# Altium schematic sheet FE.SchDoc: ThunderScope 1000E
size A4; Revision: 1
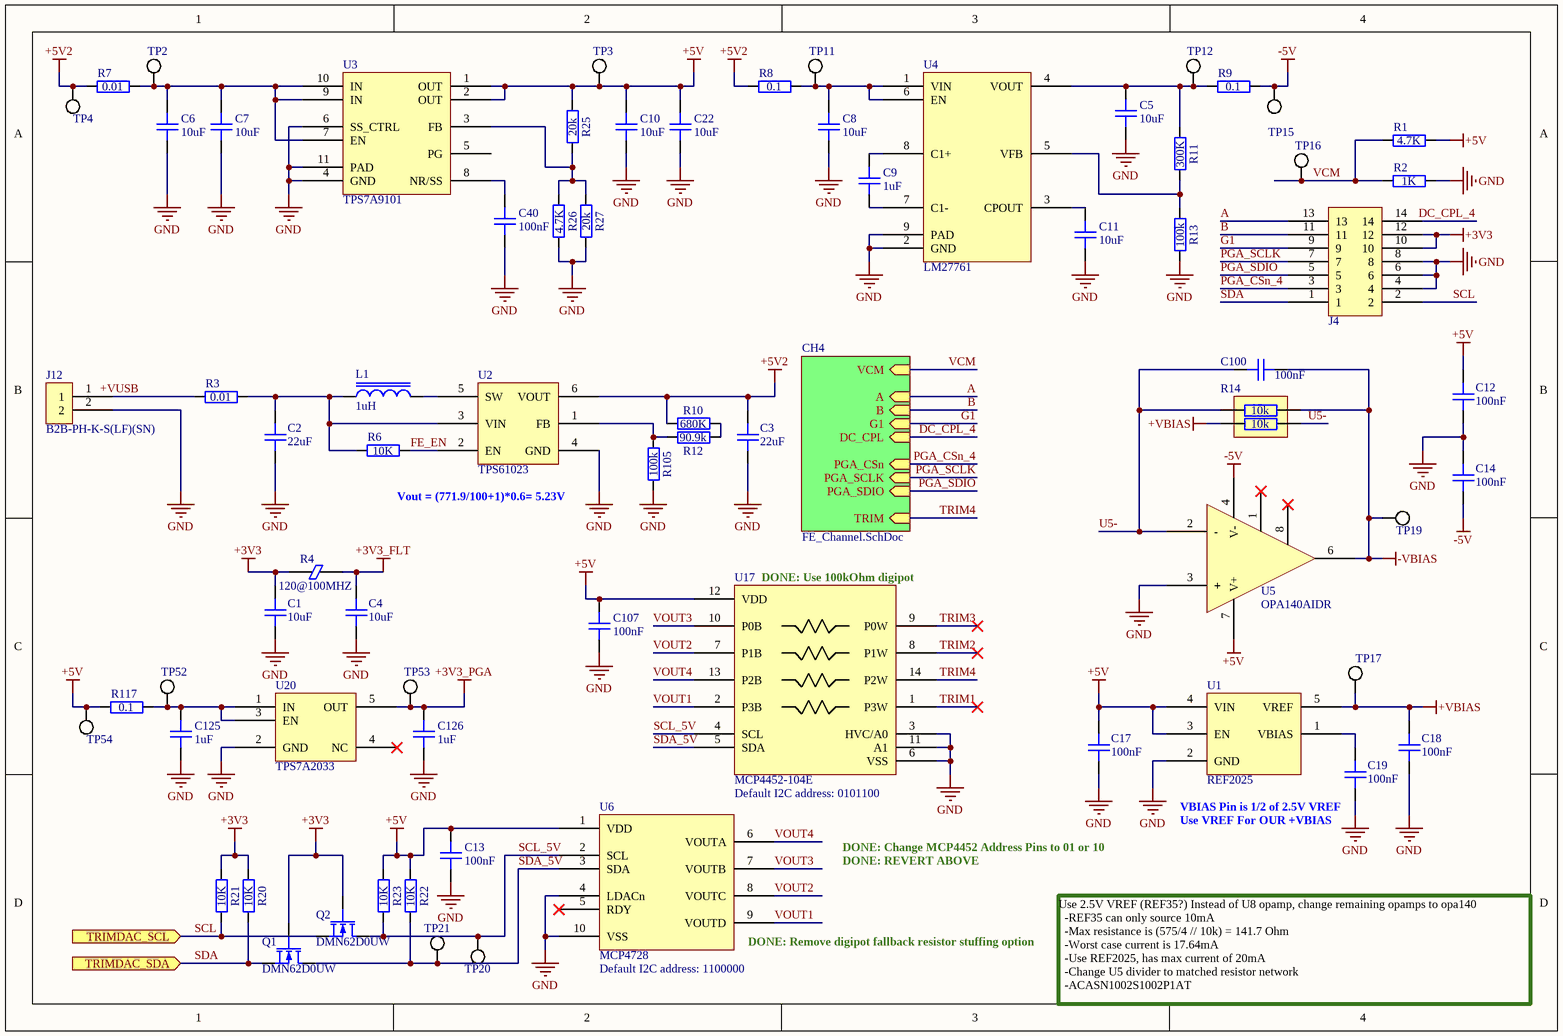
[diagram p0: FE.SchDoc]

## Parts
C1  10uF  [GEN_C_0603]
C2  22uF  [GEN_C_0805]
C3  22uF  [GEN_C_0805]
C4  10uF  [GEN_C_0603]
C5  10uF  [GEN_C_0603]
C6  10uF  [GEN_C_0603]
C7  10uF  [GEN_C_0603]
C8  10uF  [GEN_C_0603]
C9  1uF  [GEN_C_0402]
C10  10uF  [GEN_C_0603]
C11  10uF  [GEN_C_0603]
C12  100nF  [GEN_C_0402]
C13  100nF  [GEN_C_0402]
C14  100nF  [GEN_C_0402]
C17  100nF  [GEN_C_0402]
C18  100nF  [GEN_C_0402]
C19  100nF  [GEN_C_0402]
C22  10uF  [GEN_C_0603]
C40  100nF  [GEN_C_0402]
C100  100nF  [GEN_C_0402]
C107  100nF  [GEN_C_0402]
C125  1uF  [GEN_C_0402]
C126  1uF  [GEN_C_0402]
J4  2.54mm 2X7 Pin TH  [GEN_2.54mm_2X7_Pin_TH_RA]  (value not drawn)
J12  B2B-PH-K-S(LF)(SN)  [JST_B2B-PH-K-S(LF)(SN)]
L1  1uH  [GEN_L_1210]
Q1  DMN62D0UW  [GEN_SOT_323]
Q2  DMN62D0UW  [GEN_SOT_323]
R1  4.7K  [GEN_R_0402]
R2  1K  [GEN_R_0402]
R3  0.01  [GEN_R_0603]
R4  120@100MHZ  [GEN_R_0402]
R6  10K  [GEN_R_0402]
R7  0.01  [GEN_R_0603]
R8  0.1  [GEN_R_0402]
R9  0.1  [GEN_R_0402]
R10  680K  [GEN_R_0402]
R11  300K  [GEN_R_0402]
R12  90.9k  [GEN_R_0402]
R13  100k  [GEN_R_0402]
R14  10K  [GEN_R_2ARRAY_0606]  (value not drawn)
R20  10K  [GEN_R_0402]
R21  10K  [GEN_R_0402]
R22  10K  [GEN_R_0402]
R23  10K  [GEN_R_0402]
R25  20k  [GEN_R_0402]
R26  4.7K  [GEN_R_0402]
R27  20k  [GEN_R_0402]
R105  100k  [GEN_R_0402]
R117  0.1  [GEN_R_0402]
TP2  PCB  [GEN_TP_PCB]  (value not drawn)  (no BOM)
TP3  PCB  [GEN_TP_PCB]  (value not drawn)  (no BOM)
TP4  PCB  [GEN_TP_PCB]  (value not drawn)  (no BOM)
TP11  PCB  [GEN_TP_PCB]  (value not drawn)  (no BOM)
TP12  PCB  [GEN_TP_PCB]  (value not drawn)  (no BOM)
TP15  PCB  [GEN_TP_PCB]  (value not drawn)  (no BOM)
TP16  PCB  [GEN_TP_PCB]  (value not drawn)  (no BOM)
TP17  PCB  [GEN_TP_PCB]  (value not drawn)  (no BOM)
TP19  PCB  [GEN_TP_PCB]  (value not drawn)  (no BOM)
TP20  PCB  [GEN_TP_PCB]  (value not drawn)  (no BOM)
TP21  PCB  [GEN_TP_PCB]  (value not drawn)  (no BOM)
TP52  PCB  [GEN_TP_PCB]  (value not drawn)  (no BOM)
TP53  PCB  [GEN_TP_PCB]  (value not drawn)  (no BOM)
TP54  PCB  [GEN_TP_PCB]  (value not drawn)  (no BOM)
U1  REF2025  [GEN_SOT23_5_950_2900X1600X1450]
U2  TPS61023  [TI_SOT563_DRL0006A]
U3  TPS7A9101  [TI_WSON10_DSK0010A]
U4  LM27761  [TI_WSON8_DSG0008A]
U5  OPA140AIDR  [TI_SOIC8_D0008A]
U6  MCP4728  [MC_MSOP10_UN]
U17  MCP4452-104E  [MC_TSSOP14]
U20  TPS7A2033  [GEN_SOT23_5_950_2900X1600X1450]

## Sub-sheets
CH4 = FE_Channel.SchDoc: VCM (in), TRIM (in), B (in), DC_CPL (in), PGA_CSn (in), PGA_SCLK (in), PGA_SDIO (in), A (in), G1 (in)

## Ports
TRIMDAC_SCL (in), TRIMDAC_SDA (in)

## Nets
+3V3: C1.2 J4.10 J4.12 Q1.2(G) Q2.2(G) R4.1 R20.2 R21.2
+3V3_FLT: C4.2 R4.2
+3V3_PGA: C126.2 TP53.1 U20.5(OUT)
+5V: C10.2 C12.1 C13.2 C17.1 C22.2 C107.2 R1.2 R22.2 R23.2 R25.2 R117.1 TP3.1 TP54.1 U1.3(EN) U1.4(VIN) U3.1(OUT) U3.2(OUT) U5.7(V+) U6.1(VDD) U17.12(VDD)
+5V2: C3.2 R7.1 R8.1 R10.2 TP4.1 U2.6(VOUT)
+VBIAS: C18.1 R14.2 TP17.1 U1.5(VREF)
-5V: C14.2 R9.2 TP15.1 U5.4(V-)
-VBIAS: C100.1 R14.4 TP19.1 U5.6(OUT)
GND: C1.1 C2.1 C3.1 C4.1 C5.1 C6.1 C7.1 C8.1 C10.1 C11.1 C12.2 C13.1 C14.1 C17.2 C18.2 C19.1 C22.1 C40.1 C107.1 C125.1 C126.1 J4.4 J4.6 J4.8 J12.2 R2.2 R13.1 R26.1 R27.1 R105.1 U1.2(GND) U2.4(GND) U3.4(GND) U3.6(SS_CTRL) U3.11(PAD) U4.2(GND) U4.9(PAD) U5.3(+) U6.4(LDACn) U6.10(VSS) U17.3(HVC/A0) U17.6(VSS) U17.11(A1) U20.2(GND)
+VUSB: J12.1 R3.2
A: J4.13 ; sheet CH4/A
B: J4.11 ; sheet CH4/B
DC_CPL_4: J4.14 ; sheet CH4/DC_CPL
FE_EN: R6.1 U2.2(EN)
G1: J4.9 ; sheet CH4/G1
PGA_CSn_4: J4.3 ; sheet CH4/PGA_CSn
PGA_SCLK: J4.7 ; sheet CH4/PGA_SCLK
PGA_SDIO: J4.5 ; sheet CH4/PGA_SDIO
SCL: J4.2 Q2.3(S) R21.1 ; port TRIMDAC_SCL
SCL_5V: Q2.1(D) R23.1 TP20.1 U6.2(SCL) U17.4(SCL)
SDA: J4.1 Q1.3(S) R20.1 ; port TRIMDAC_SDA
SDA_5V: Q1.1(D) R22.1 TP21.1 U6.3(SDA) U17.5(SDA)
TRIM1: U17.1(P3W)
TRIM2: U17.8(P1W)
TRIM3: U17.9(P0W)
TRIM4: U17.14(P2W) ; sheet CH4/TRIM
U5-: C100.2 R14.1 R14.3 U5.2(-)
VCM: R1.1 R2.1 TP16.1 ; sheet CH4/VCM
VOUT1: U6.9(VOUTD) U17.2(P3B)
VOUT2: U6.8(VOUTC) U17.7(P1B)
VOUT3: U6.7(VOUTB) U17.10(P0B)
VOUT4: U6.6(VOUTA) U17.13(P2B)
NetC2_2: C2.2 L1.1 R3.1 R6.2 U2.3(VIN)
NetC5_2: C5.2 R9.1 R11.2 TP12.1 U4.4(VOUT)
NetC6_2: C6.2 C7.2 R7.2 TP2.1 U3.7(EN) U3.9(IN) U3.10(IN)
NetC8_2: C8.2 R8.2 TP11.1 U4.1(VIN) U4.6(EN)
NetC9_1: C9.1 U4.7(C1-)
NetC9_2: C9.2 U4.8(C1+)
NetC11_2: C11.2 U4.3(CPOUT)
NetC19_2: C19.2 U1.1(VBIAS)
NetC40_2: C40.2 U3.8(NR/SS)
NetC125_2: C125.2 R117.2 TP52.1 U20.1(IN) U20.3(EN)
NetL1_2: L1.2 U2.5(SW)
NetR10_1: R10.1 R12.2
NetR11_1: R11.1 R13.2 U4.5(VFB)
NetR12_1: R12.1 R105.2 U2.1(FB)
NetR25_1: R25.1 R26.2 R27.2 U3.3(FB)

Not connected (* = marked no-connect by the designer): U3 5(PG); U5 1(N1)* 8(N2)*; U6 5(RDY)*; U20 4(NC)*

## Notes on the sheet
- Vout = (771.9/100+1)*0.6= 5.23V
- (near U17) DONE: Use 100kOhm digipot
- Default I2C address: 0101100
- DONE: Change MCP4452 Address Pins to 01 or 10
- (near C19) VBIAS Pin is 1/2 of 2.5V VREF
- Use VREF For OUR +VBIAS
- DONE: REVERT ABOVE
- (near U6) Default I2C address: 1100000
- (near U6) DONE: Remove digipot fallback resistor stuffing option
- Use 2.5V VREF (REF35?) Instead of U8 opamp, change remaining opamps to opa140
  -REF35 can only source 10mA
  -Max resistance is (575/4 // 10k) = 141.7 Ohm
  -Worst case current is 17.64mA
  -Use REF2025, has max current of 20mA
  -Change U5 divider to matched resistor network
  -ACASN1002S1002P1AT
- Aleksa Bjelogrlic
- (in symbol RES ARRAY 2x 10K OHM 0.05% 0606) 10k

## Library data of the parts
C1 C4 = CAP 10uF 10V X5R 0603: Manufacturer: Murata; House Part Number: C-10uF-0603-002; Manufacturer Part Number: GRM188R61A106ME69D; Voltage Rating: 10V; Package: 0402; Value: 10uF; Supplier 1: Mouser; Supplier Part Number 1: 81-GRM188R61A106ME9D
C2 C3 = CAP 22uF 25V X5R 0805: House Part Number: C-22uF-0805-002; Manufacturer: Murata; Manufacturer Part Number: GRM21BR61E226ME44L; Voltage Rating: 25V; Package: 0805; Value: 22uF; Supplier 1: Mouser; Supplier Part Number 1: 81-GRM21BR61E226ME4L
C5-C8 C10 C11 C22 = CAP 10uF 10V X5R 0603: House Part Number: C-10uF-0603-002; Manufacturer: Murata; Manufacturer Part Number: GRM188R61A106ME69D; Voltage Rating: 10V; Package: 0402; Supplier 1: Mouser; Supplier Part Number 1: 81-GRM188R61A106ME9D; Value: 10uF
C9 C125 C126 = CAP 1uF 25V X5R 0402: Manufacturer: Murata; Manufacturer Part Number: GRM155R61E105KA12D; Voltage Rating: 25V; Package: 0402; Supplier 1: Mouser; Supplier Part Number 1: 81-GRM155R61E105KA2D; Value: 1uF
C12-C14 C17-C19 C100 C107 = CAP 100nF 16V X7R 0402: House Part Number: C-100nF-0402-002; Manufacturer: Murata; Manufacturer Part Number: GCM155R71C104KA55D; Voltage Rating: 16V; Package: 0402; Supplier 1: Mouser; Supplier Part Number 1: 81-GCM155R71C104KA5D; Value: 100nF
C40 = CAP 100nF 16V X7R 0402: Manufacturer: Murata; House Part Number: C-100nF-0402-002; Manufacturer Part Number: GCM155R71C104KA55D; Voltage Rating: 16V; Package: 0402; Supplier 1: Mouser; Supplier Part Number 1: 81-GCM155R71C104KA5D; Value: 100nF
J4 = CONN 2.54mm 2X7 Pin TH RA: Supplier 1: Digi-Key; Supplier Part Number 1: S9203-ND
J12 = CONN JST PH 2 Pin TH: Manufacturer: JST; Manufacturer Part Number: B2B-PH-K-S-LF-SN; Supplier 1: Digi-Key; Supplier Part Number 1: 455-1704-ND
L1 = IND 1uH 3.1A 45 MOHM 1210: Manufacturer: Murata; Manufacturer Part Number: 1277AS-H-1R0M=P2; Value: 1uH; Supplier 1: Mouser; Supplier Part Number 1: 81-1277AS-H-1R0MP2
Q1 Q2 = NMOS DMN62D0UW: House Part Number: DMN62D0UW-7; Manufacturer: Diodes; Vdss: 60V; Supplier 1: Mouser; Supplier Part Number 1: 621-DMN62D0UW-7; Manufacturer Part Number: DMN62D0UW-7
R1 R26 = RES 4.7K OHM 1% 1/10W 0402: Manufacturer: Panasonic; Manufacturer Part Number: ERJ-2RKF4701X; Tolerance: 1%; Package: 0402; Supplier 1: Mouser; Supplier Part Number 1: 667-ERJ-2RKF4701X; Value: 4.7K
R2 = RES 1K OHM 1% 1/10W 0402: Manufacturer: Yageo; House Part Number: R-1K-0402-1%-001; Manufacturer Part Number: RC0402FR-071KL; Tolerance: 1%; Package: 0402; Value: 1K; Supplier 1: Mouser; Supplier Part Number 1: 603-RC0402FR-071KL
R3 R7 = RES 0.01 OHM 1% 1/4W 0603: House Part Number: R-0.01-0603-1%-001; Manufacturer: Susumu; Manufacturer Part Number: RL0816T-R010-F; Tolerance: 1%; Supplier 1: Mouser; Supplier Part Number 1: 754-RL0816T-R010-F; Value: 0.01; Package: 0603
R4 = FERRITE BEAD 120 OHM 0402: Manufacturer: Murata; House Part Number: BLM15PX121SN1D; Manufacturer Part Number: BLM15PX121SN1D; Supplier 1: Mouser; Supplier Part Number 1: 81-BLM15PX121SN1D
R6 R20-R23 = RES 10K OHM 1% 1/10W 0402: Manufacturer: Panasonic; Manufacturer Part Number: ERJ-2RKF1002X; Tolerance: 1%; Package: 0402; Supplier 1: Mouser; Supplier Part Number 1: 667-ERJ-2RKF1002X; Value: 10K
R8 R9 R117 = RES 0.1 OHM 1% 1/6W 0402: Manufacturer: Panasonic; Manufacturer Part Number: ERJ-2BSFR10X; Tolerance: 1%; Package: 0402; Supplier 1: Mouser; Supplier Part Number 1: 667-ERJ-2BSFR10X; Value: 0.1
R10 = RES 680K OHM 1% 1/16W 0402: Manufacturer: Yageo; Manufacturer Part Number: RC0402FR-07681KL; Tolerance: 1%; Package: 0402; Supplier 1: Mouser; Supplier Part Number 1: 603-RC0402FR-07680KL; Value: 680K
R11 = RES 300K OHM 1% 1/10W 0402: Manufacturer: Panasonic; Manufacturer Part Number: ERJ-2RKF3003X; Tolerance: 1%; Package: 0402; Supplier 1: Mouser; Supplier Part Number 1: 667-ERJ-2RKF3003X; Value: 300K
R12 = RES 90.9K OHM 1% 1/16W 0402: Manufacturer: Yageo; Manufacturer Part Number: RC0402FR-0790K9L; Tolerance: 1%; Package: 0402; Supplier 1: Mouser; Supplier Part Number 1: 603-RC0402FR-0790K9L; Value: 90.9k
R13 R105 = RES 100K OHM 1% 1/10W 0402: House Part Number: R-100K-0402-1%-001; Manufacturer: Yageo; Manufacturer Part Number: RC0402FR-07100KL; Tolerance: 1%; Package: 0402; Supplier 1: Mouser; Supplier Part Number 1: 603-RC0402FR-07100KL; Value: 100k
R14 = RES ARRAY 2x 10K OHM 0.05% 0606: Manufacturer: Vishay Beyschlag; Manufacturer Part Number: ACASN1002S1002P1ATF1002X; Tolerance: 1%; Package: 0606; Value: 10K; Supplier 1: Mouser; Supplier Part Number 1: 594-ACASN1002S1002AT
R25 R27 = RES 20K OHM 1% 1/16W 0402: Manufacturer: Yageo; Manufacturer Part Number: RC0402FR-0720KL; Tolerance: 1%; Package: 0402; Supplier 1: Mouser; Supplier Part Number 1: 603-RC0402FR-0720KL; Value: 20k
TP2-TP4 TP11 TP12 TP15-TP17 TP19-TP21 TP52-TP54 = TP PCB 1mm
U1 = IC VREF REF2025: Supplier 1: Texas Instruments; Supplier Part Number 1: REF2025AIDDCR
U2 = IC BOOST TPS61023: Manufacturer: Texas Instruments; Manufacturer Part Number: TPS61023DRLT; Supplier 1: Texas Instruments; Supplier Part Number 1: TPS61023DRLT
U3 = IC LDO TPS7A9101: Supplier 1: Digi-Key; Supplier Part Number 1: 296-45298-1-ND
U4 = IC CPUMP LM27761: Manufacturer: Texas Instruments; Manufacturer Part Number: LM27761DSGR; Supplier 1: Texas Instruments; Supplier Part Number 1: LM27761DSGR
U5 = IC OPAMP OPA140: Manufacturer: Texas Instruments; Supplier 1: Texas Instruments; Supplier Part Number 1: OPA140AIDR; Manufacturer Part Number: OPA140AIDR
U6 = IC DAC QUAD MCP4728: Manufacturer: Microchip; Supplier 1: Mouser; Supplier Part Number 1: 579-MCP4728A1T-E/UN; Manufacturer Part Number: MCP4728
U17 = IC DIGIPOT QUAD MCP4452-104E: Manufacturer: Microchip; Supplier 1: Mouser; Supplier Part Number 1: 579-MCP4452-104E/ST; Manufacturer Part Number: MCP4452-104E
U20 = IC LDO TPS7A2033: Manufacturer: Texas Instruments; Manufacturer Part Number: TPS7A2033PDBVR; Supplier 1: Texas Instruments; Supplier Part Number 1: TPS7A2033PDBVR